# EAGLE design pca9544a_pcb (EAGLE 7.5.0)
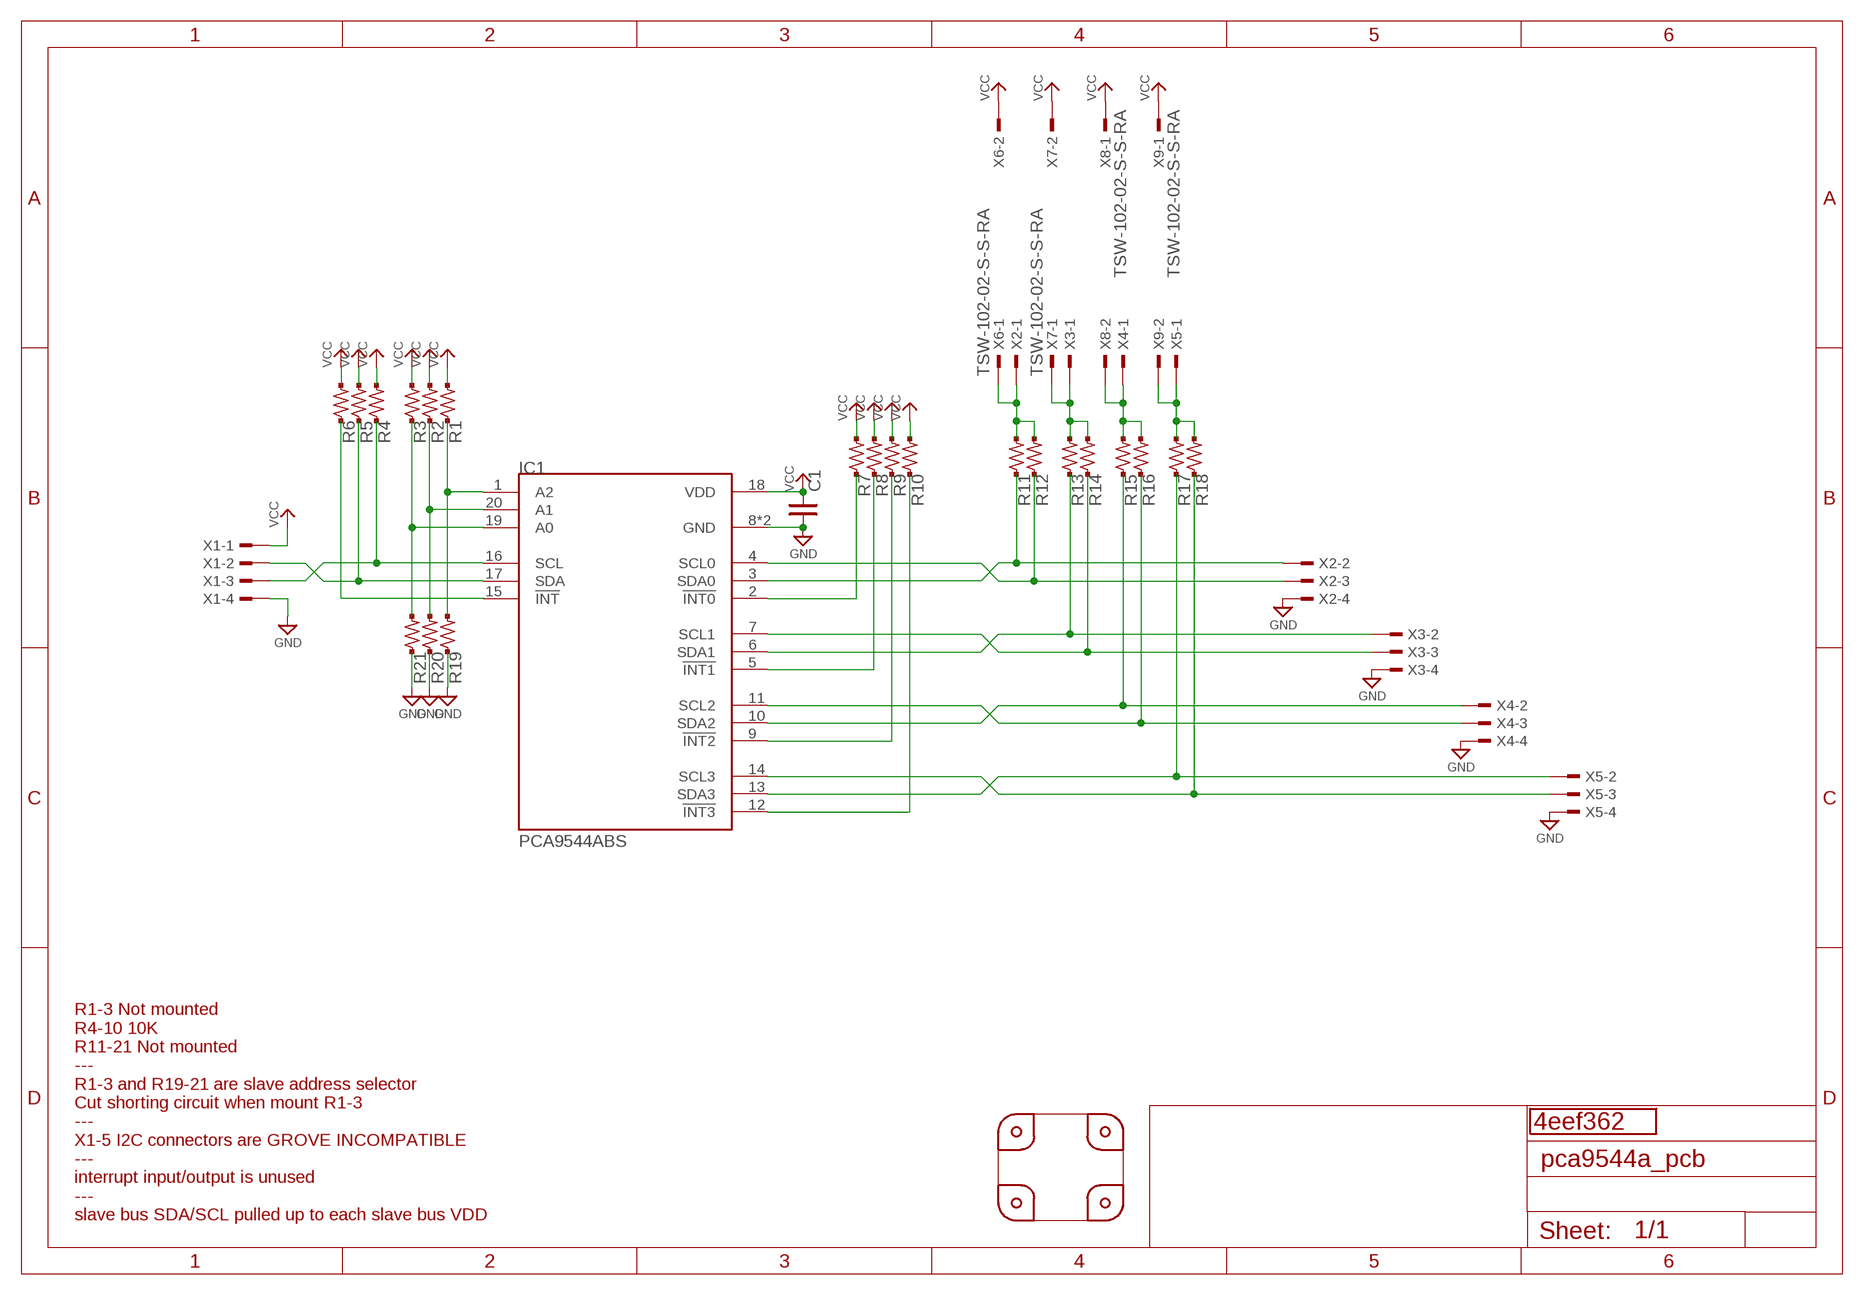
[diagram p0: schematic, sheet 1]

## Parts
C1  C-SMD-0.1U-1608  [CR-1608]
GIT1  4eef362  GIT-REVISION_1.2  [GIT-REVISION_1.2]
IC1  PCA9544ABS  [QFN20-0.65P5.0X5.0]
P1  PCB-CORNER  [PCB-CORNER]
P2  PCB-CORNER  [PCB-CORNER]
P3  PCB-CORNER  [PCB-CORNER]
P4  PCB-CORNER  [PCB-CORNER]
R1  R-US-10K-1608  [R-1608-PADPAD]
R2  R-US-10K-1608  [R-1608-PADPAD]
R3  R-US-10K-1608  [R-1608-PADPAD]
R4  R-US-10K-1608  [R-1608-PADPAD]
R5  R-US-10K-1608  [R-1608-PADPAD]
R6  R-US-10K-1608  [R-1608-PADPAD]
R7  R-US-10K-1608  [R-1608-PADPAD]
R8  R-US-10K-1608  [R-1608-PADPAD]
R9  R-US-10K-1608  [R-1608-PADPAD]
R10  R-US-10K-1608  [R-1608-PADPAD]
R11  R-US-10K-1608  [R-1608-PADPAD]
R12  R-US-10K-1608  [R-1608-PADPAD]
R13  R-US-10K-1608  [R-1608-PADPAD]
R14  R-US-10K-1608  [R-1608-PADPAD]
R15  R-US-10K-1608  [R-1608-PADPAD]
R16  R-US-10K-1608  [R-1608-PADPAD]
R17  R-US-10K-1608  [R-1608-PADPAD]
R18  R-US-10K-1608  [R-1608-PADPAD]
R19  R-US--1005SHORT  [R0402SHORT]
R20  R-US--1005SHORT  [R0402SHORT]
R21  R-US--1005SHORT  [R0402SHORT]
X1  S4B-XH-A  [S4B-XH-A(LF)(SN)]
X2  S4B-XH-A  [S4B-XH-A(LF)(SN)]
X3  S4B-XH-A  [S4B-XH-A(LF)(SN)]
X4  S4B-XH-A  [S4B-XH-A(LF)(SN)]
X5  S4B-XH-A  [S4B-XH-A(LF)(SN)]
X6  TSW-102-02-S-S-RA  [TSW-102-02-S-S-RA]
X7  TSW-102-02-S-S-RA  [TSW-102-02-S-S-RA]
X8  TSW-102-02-S-S-RA  [TSW-102-02-S-S-RA]
X9  TSW-102-02-S-S-RA  [TSW-102-02-S-S-RA]

## Nets
GND: C1.2 IC1.8(GND) IC1.EP(GND) R19.1 R19.2 R20.1 R20.2 R21.1 R21.2 X1.4 X2.4 X3.4 X4.4 X5.4
N$1: IC1.1(A2) R1.1 R19.3
N$2: IC1.20(A1) R2.1 R20.3
N$3: IC1.19(A0) R3.1 R21.3
N$4: IC1.16(SCL) R4.1 X1.3
N$5: IC1.17(SDA) R5.1 X1.2
N$6: IC1.15(!INT!) R6.1
N$7: IC1.4(SCL0) R12.1 X2.3
N$8: IC1.3(SDA0) R11.1 X2.2
N$9: IC1.2(!INT0!) R7.1
N$10: IC1.7(SCL1) R14.1 X3.3
N$11: IC1.6(SDA1) R13.1 X3.2
N$12: IC1.5(!INT1!) R8.1
N$13: IC1.11(SCL2) R16.1 X4.3
N$14: IC1.10(SDA2) R15.1 X4.2
N$15: IC1.9(!INT2!) R9.1
N$16: IC1.14(SCL3) R18.1 X5.3
N$17: IC1.13(SDA3) R17.1 X5.2
N$18: IC1.12(!INT3!) R10.1
N$19: R11.2 R12.2 X2.1 X6.1
N$20: R13.2 R14.2 X3.1 X7.1
N$21: R15.2 R16.2 X4.1 X8.2
N$22: R17.2 R18.2 X5.1 X9.2
VCC: C1.1 IC1.18(VDD) R1.2 R2.2 R3.2 R4.2 R5.2 R6.2 R7.2 R8.2 R9.2 R10.2 X1.1 X6.2 X7.2 X8.1 X9.1

## Notes on the sheet
- R1-3 Not mounted
  R4-10 10K
  R11-21 Not mounted
  ---
  R1-3 and R19-21 are slave address selector
  Cut shorting circuit when mount R1-3
  ---
  X1-5 I2C connectors are GROVE INCOMPATIBLE
  ---
  interrupt input/output is unused
  ---
  slave bus SDA/SCL pulled up to each slave bus VDD

## Library data of the parts
C1 = mylib:C-SMD-*: SMD CAPACITOR; AKIZUKI: P-05650; SMD-PAD: 2
GIT1 = git-revision:GIT-REVISION; NOT_COMPONENT: YES
IC1 = mylib:PCA9544A
P1-P4 = mylib:PCB-CORNER; NOT-COMPONENT: YES
R1-R18 = mylib:R-US-*: SMD resistor Packages : -1608 : 1.6 x 0.8 mm -2125 : 2.0 x 1.25 mm -3216 : 3.2 x 1.6 mm
R19-R21 = mylib:R-US-*: SMD resistor Packages : -1608 : 1.6 x 0.8 mm -2125 : 2.0 x 1.25 mm -3216 : 3.2 x 1.6 mm; NOT-COMPONENT: YES
X1-X5 = mylib:S4B-XH-A
X6-X9 = con-samtec.local:TSW-102-02-S-S: THROUGH-HOLE POST HEADER Source: Samtec TSW.pdf

## Board
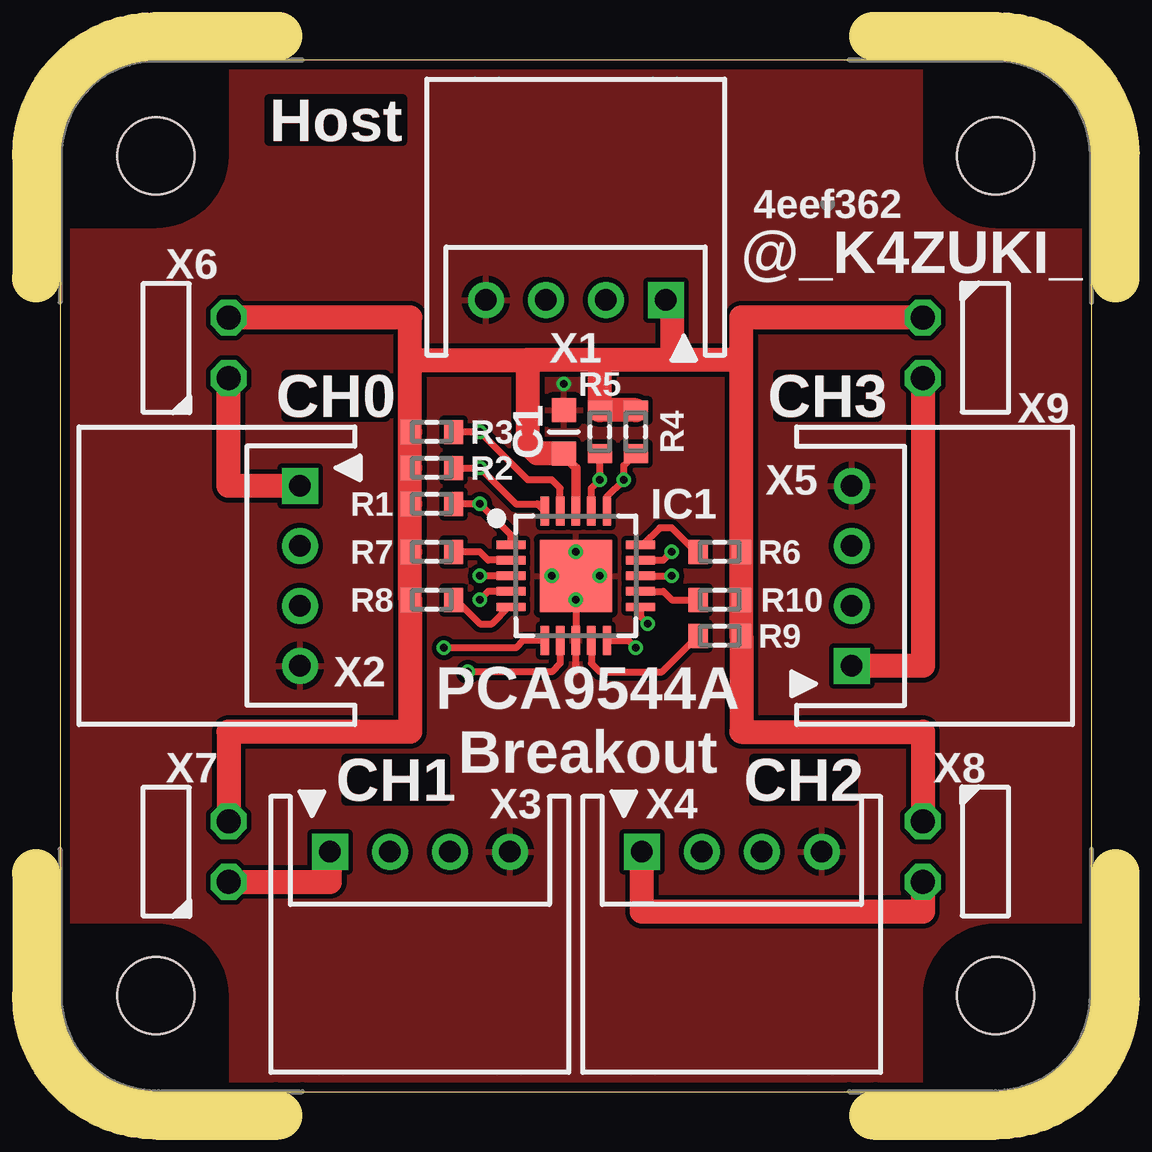
[diagram p1: board, top side]
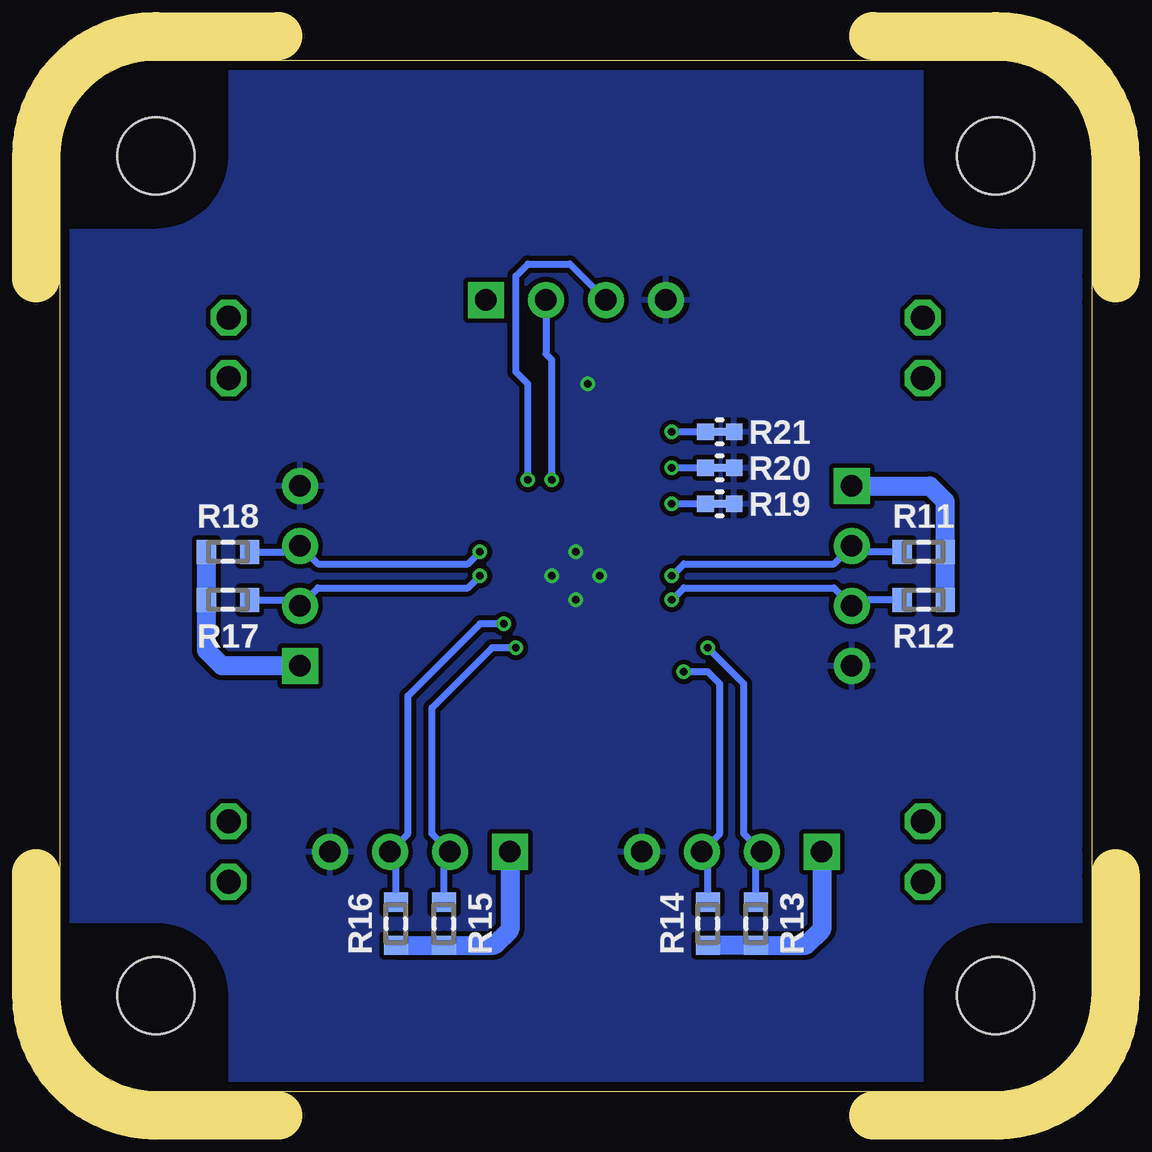
[diagram p2: board, bottom side, seen from below]

Size 43 x 43 mm. Coordinates in mm from the lower left corner, seen from the top.
Outline: 9,0 34,0
Outline: 43,9 43,34
Outline: 34,43 9,43
Outline: 0,34 0,9
Copper layers (1*16): Top 0.035mm / dielectric 1.5mm / Bottom 0.035mm
Design rules "default *": minimum track width 0.15mm, minimum drill 0.3mm, track to track 0.2mm, track to pad 0.2mm, pad to pad 0.2mm, via to via 0.2mm, smd to smd 0mil, copper to edge 0.4mm, drill to drill 8mil, minimum pad ring 0.15mm, minimum via ring 0.15mm, stop-mask expansion 4mil, vias tented up to drill 100mil, thermal gap 10mil
tRestrict: area 20,20 to 23,23

### Footprints (pad centres in the part's own frame; a part is rotated, then mirrored left to right if it is on the bottom)
CR-1608 = smd 1 x 1: 1 -0.9,0; 2 0.9,0
QFN20-0.65P5.0X5.0 = smd 1.2 x 0.35: 1 -2.7,1.3; 2 -2.7,0.65; 3 -2.7,0; 4 -2.7,-0.65; 5 -2.7,-1.3; 11 2.7,-1.3; 12 2.7,-0.65; 13 2.7,0; 14 2.7,0.65; 15 2.7,1.3 | smd 0.35 x 1.2: 6 -1.3,-2.7; 7 -0.65,-2.7; 8 0,-2.7; 9 0.65,-2.7; 10 1.3,-2.7; 16 1.3,2.7; 17 0.65,2.7; 18 0,2.7; 19 -0.65,2.7; 20 -1.3,2.7 | smd 3 x 3: EP 0,0
PCB-CORNER = hole 3.2: 0,0
R-1608-PADPAD = smd 0.8 x 1: 1 -0.9,0; 2 0.9,0
R0402SHORT = smd 0.7 x 0.7: 1 -0.6,0; 3 0.6,0 | smd 0.8 x 0.3: 2 0,0
S4B-XH-A(LF)(SN) = drill 0.9 pad 1.5 square: 1 -3.75,0 | drill 0.9 pad 1.5: 2 -1.25,0; 3 1.25,0; 4 3.75,0
TSW-102-02-S-S-RA = drill 1 pad 1.5 octagon: 1 1.27,1.524; 2 -1.27,1.524

### Placement (x,y rotation side)
C1  21,27.5 90 top
GIT1  32,37 0 top
IC1  21.5,21.5 0 top
P1  39,39 90 top
P2  39,4 0 top
P3  4,39 180 top
P4  4,4 270 top
R1  15.5,24.5 180 top
R2  15.5,26 180 top
R3  15.5,27.5 180 top
R4  24,27.5 90 top
R5  22.5,27.5 90 top
R6  27.5,22.5 0 top
R7  15.5,22.5 180 top
R8  15.5,20.5 180 top
R9  27.5,19 0 top
R10  27.5,20.5 0 top
R11  7,22.5 0 bottom
R12  7,20.5 0 bottom
R13  14,7 270 bottom
R14  16,7 270 bottom
R15  27,7 270 bottom
R16  29,7 270 bottom
R17  36,20.5 180 bottom
R18  36,22.5 180 bottom
R19  15.5,24.5 180 bottom
R20  15.5,26 180 bottom
R21  15.5,27.5 180 bottom
X1  21.5,33 180 top
X2  10,21.5 270 top
X3  15,10 0 top
X4  28,10 0 top
X5  33,21.5 90 top
X6  5.5,31 270 top
X7  5.5,10 270 top
X8  37.5,10 90 top
X9  37.5,31 90 top

### Tracks (layer width: path | path; a pad name or v marks a point on that pad's centre or on a via)
GND  (via drill 0.3 pad 0.6)
  Top 0.3: 21.5,17.5 IC1.8 | IC1.8 21.5,19 | IC1.EP IC1.8
  other vias: 21,29.5 21.5,22.5 20.5,21.5 21.5,20.5 22.5,21.5
  pour Top: 0,43 43,43 43,0 0,0
  pour Bottom: 0,43 43,43 43,0 0,0
N$1  (via drill 0.3 pad 0.6)
  Top 0.3: R1.1 v17.5,24.5 18.8,23.2 IC1.1
  Bottom 0.3: R19.3 v17.5,24.5
N$2  (via drill 0.3 pad 0.6)
  Top 0.3: R2.1 v17.5,26 19,24.5 19.9,24.5 | 19.9,24.5 IC1.20 | 19.9,24.5 20.2,24.5
  Bottom 0.3: R20.3 v17.5,26
N$3  (via drill 0.3 pad 0.6)
  Top 0.3: IC1.19 20.85,25.15 20.5,25.5 19.5,25.5 v17.5,27.5 R3.1
  Bottom 0.3: R21.3 v17.5,27.5
N$4  (via drill 0.3 pad 0.6)
  Top 0.3: IC1.16 22.8,24.8 v23.5,25.5 23.5,26.1 R4.1
  Bottom 0.3: v23.5,25.5 23.5,29.5 24,30 24,34 23.5,34.5 21.75,34.5 X1.3
N$5  (via drill 0.3 pad 0.6)
  Top 0.3: IC1.17 22.15,25.15 v22.5,25.5 R5.1
  Bottom 0.3: v22.5,25.5 22.5,30.5 22.75,30.75 X1.2
N$6
  Top 0.3: IC1.15 24.3,22.8 25,23.5 25.5,23.5 26.5,22.5 R6.1
N$7  (via drill 0.3 pad 0.6)
  Top 0.3: IC1.4 17.85,20.85 v17.5,20.5
  Bottom 0.3: R12.1 9.73,20.5 X2.3 10.75,21 17,21 v17.5,20.5
N$8  (via drill 0.3 pad 0.6)
  Top 0.3: IC1.3 v17.5,21.5
  Bottom 0.3: v17.5,21.5 17,22 10.75,22 X2.2 9.73,22.5 R11.1
N$9
  Top 0.3: IC1.2 17.85,22.15 17.5,22.5 R7.1
N$10  (via drill 0.3 pad 0.6)
  Top 0.3: IC1.7 20.85,17.85 20.5,17.5 v17,17.5
  Bottom 0.3: R14.1 16,9.73 X3.3 15.5,10.75 15.5,17 16,17.5 v17,17.5
N$11  (via drill 0.3 pad 0.6)
  Top 0.3: IC1.6 19.3,18.8 19,18.5 v16,18.5
  Bottom 0.3: R13.1 14,9.73 X3.2 14.5,10.75 14.5,17 v16,18.5
N$12
  Top 0.3: IC1.5 18.7,20.2 18,19.5 17.5,19.5 16.5,20.5 R8.1
N$13  (via drill 0.3 pad 0.6)
  Top 0.3: IC1.11 24.2,19.8 v24.5,19.5
  Bottom 0.3: R16.1 29,9.73 X4.3 28.5,10.75 28.5,16.5 25.5,19.5 v24.5,19.5
N$14  (via drill 0.3 pad 0.6)
  Top 0.3: IC1.10 23.7,18.8 v24,18.5
  Bottom 0.3: R15.1 27,9.73 X4.2 27.5,10.75 27.5,16 25,18.5 v24,18.5
N$15
  Top 0.3: IC1.9 22.15,17.85 22.5,17.5 25.1,17.5 R9.1
N$16  (via drill 0.3 pad 0.6)
  Top 0.3: IC1.14 25.15,22.15 v25.5,22.5
  Bottom 0.3: R18.1 33.27,22.5 X5.3 32.25,22 26,22 v25.5,22.5
N$17  (via drill 0.3 pad 0.6)
  Top 0.3: IC1.13 v25.5,21.5
  Bottom 0.3: R17.1 33.27,20.5 X5.2 32.25,21 26,21 v25.5,21.5
N$18
  Top 0.3: IC1.12 25.15,20.85 25.5,20.5 R10.1
N$19
  Top 1: X2.1 7.02,25.25 X6.1
  Bottom 0.8: R12.2 R11.2 6.1,24.6 6.75,25.25 X2.1
N$20
  Top 1: X7.1 11.25,8.73 X3.1
  Bottom 0.8: X3.1 11.25,6.75 11.9,6.1 R13.2 R14.2
N$21
  Top 1: X8.2 35.98,7.5 24.25,7.5 X4.1
  Bottom 0.8: R16.2 R15.2 24.9,6.1 24.25,6.75 X4.1
N$22
  Top 1: X9.2 35.98,17.75 X5.1
  Bottom 0.8: R18.2 R17.2 36.9,18.4 36.25,17.75 X5.1
VCC
  Top 0.3: X1.1 25.5,33
  Top 0.4: IC1.18 21.5,26 21,26.5 C1.1
  Top 1: 28.4,30.5 25.5,30.5 | 25.5,30.5 22.5,30.5 | 22.5,30.5 19.5,30.5 | C1.1 19.9,26.6 19.5,27 19.5,30.5 | R4.2 R5.2 22.5,30.5 | 14.6,30.5 19.5,30.5 | 28.4,30.5 R6.2 R10.2 R9.2 28.4,15 35.98,15 X8.1 | 14.6,30.5 R3.2 R2.2 R1.2 R7.2 R8.2 14.6,15 7.02,15 X7.2 | 25.5,33 25.5,30.5 | X9.1 28.4,32.27 28.4,30.5 | 14.6,30.5 14.6,32.27 X6.2

### Text on the board
Top: Host | CH0 | CH3 | CH1 | CH2
tPlace: Host | @_K4ZUKI_ | CH0 | CH3 | PCA9544A / Breakout | CH1 | CH2